# EAGLE schematic scheme (EAGLE 8.7.1)
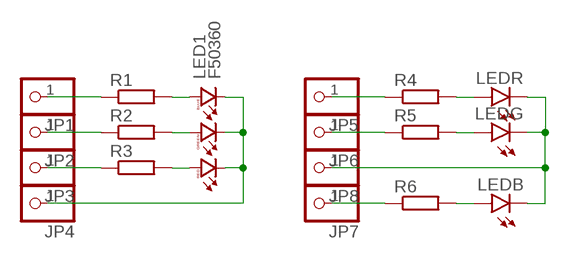
[diagram p0: schematic, sheet 1]

## Parts
JP1  PINHD-1X1  [1X01]
JP2  PINHD-1X1  [1X01]
JP3  PINHD-1X1  [1X01]
JP4  PINHD-1X1  [1X01]
JP5  PINHD-1X1  [1X01]
JP6  PINHD-1X1  [1X01]
JP7  PINHD-1X1  [1X01]
JP8  PINHD-1X1  [1X01]
LED1  F50360  [F50360]
LEDB  LED10MM  [LED10MM]
LEDG  LED10MM  [LED10MM]
LEDR  LED10MM  [LED10MM]
R1  R-EU_0414/15  [0414/15]
R2  R-EU_0414/15  [0414/15]
R3  R-EU_0414/15  [0414/15]
R4  R-EU_0414/15  [0414/15]
R5  R-EU_0414/15  [0414/15]
R6  R-EU_0414/15  [0414/15]

## Nets
N$1: LED1.BA R1.2
N$2: LED1.GA R2.2
N$3: LED1.RA R3.2
N$4: JP4.1 LED1.BC LED1.GC LED1.RC
N$5: JP3.1 R3.1
N$6: JP2.1 R2.1
N$7: JP1.1 R1.1
N$8: LEDR.A R4.2
N$9: LEDG.A R5.2
N$10: LEDB.A R6.2
N$11: JP8.1 LEDB.K(C) LEDG.K(C) LEDR.K(C)
N$12: JP7.1 R6.1
N$13: JP6.1 R5.1
N$14: JP5.1 R4.1

## Library data of the parts
JP1-JP8 = pinhead:PINHD-1X1: PIN HEADER
LED1 = led:F50360: Full color Z-Power LED RGB P5-II Series Source: http://www.seoulsemicon.co.kr .. F50360.pdf
LEDB LEDG LEDR = led:LED: LED OSRAM: - CHIPLED LG R971, LG N971, LY N971, LG Q971, LY Q971, LO R971, LY R971 LH N974, LH R974 LS Q976, LO Q976, LY Q976 LO Q996 - Hyper CHIPLED LW Q18S LB Q993, LB Q99A, LB R99A - SideLED LS A670, LO A670, LY A670, LG A670, LP A670 LB A673, LV A673, LT A673, LW A673 LH A674 LY A675 LS A676, LA A676, LO A676, LY A676, LW A676 LS A679, LY A679, LG A679 - Hyper Micro SIDELED® LS Y876, LA Y876, LO Y876, LY Y876 LT Y87S - SmartLED LW L88C, LW L88S LB L89C, LB L89S, LG L890 LS L89K, LO L89K, LY L89K LS L896, LA L896, LO L896, LY L896 - TOPLED LS T670, LO T670, LY T670, LG T670, LP T670 LSG T670, LSP T670, LSY T670, LOP T670, LYG T670 LG T671, LOG T671, LSG T671 LB T673, LV T673, LT T673, LW T673 LH T674 LS T676, LA T676, LO T676, LY T676, LB T676, LH T676, LSB T676, LW T676 LB T67C, LV T67C, LT T67C, LS T67K, LO T67K, LY T67K, LW E67C LS E67B, LA E67B, LO E67B, LY E67B, LB E67C, LV E67C, LT E67C LW T67C LS T679, LY T679, LG T679 LS T770, LO T770, LY T770, LG T770, LP T770 LB T773, LV T773, LT T773, LW T773 LH T774 LS E675, LA E675, LY E675, LS T675 LS T776, LA T776, LO T776, LY T776, LB T776 LHGB T686 LT T68C, LB T68C - Hyper Mini TOPLED® LB M676 - Mini TOPLED Santana® LG M470 LS M47K, LO M47K, LY M47K Source: http://www.osram.convergy.de LUXEON: - LUMILED® LXK2-PW12-R00, LXK2-PW12-S00, LXK2-PW14-U00, LXK2-PW14-V00 LXK2-PM12-R00, LXK2-PM12-S00, LXK2-PM14-U00 LXK2-PE12-Q00, LXK2-PE12-R00, LXK2-PE12-S00, LXK2-PE14-T00, LXK2-PE14-U00 LXK2-PB12-K00, LXK2-PB12-L00, LXK2-PB12-M00, LXK2-PB14-N00, LXK2-PB14-P00, LXK2-PB14-Q00 LXK2-PR12-L00, LXK2-PR12-M00, LXK2-PR14-Q00, LXK2-PR14-R00 LXK2-PD12-Q00, LXK2-PD12-R00, LXK2-PD12-S00 LXK2-PH12-R00, LXK2-PH12-S00 LXK2-PL12-P00, LXK2-PL12-Q00, LXK2-PL12-R00 Source: www.luxeon.com KINGBRIGHT: KA-3528ASYC Source: www.kingbright.com
R1-R6 = rcl:R-EU_: RESISTOR, European symbol; SPICEPREFIX: R